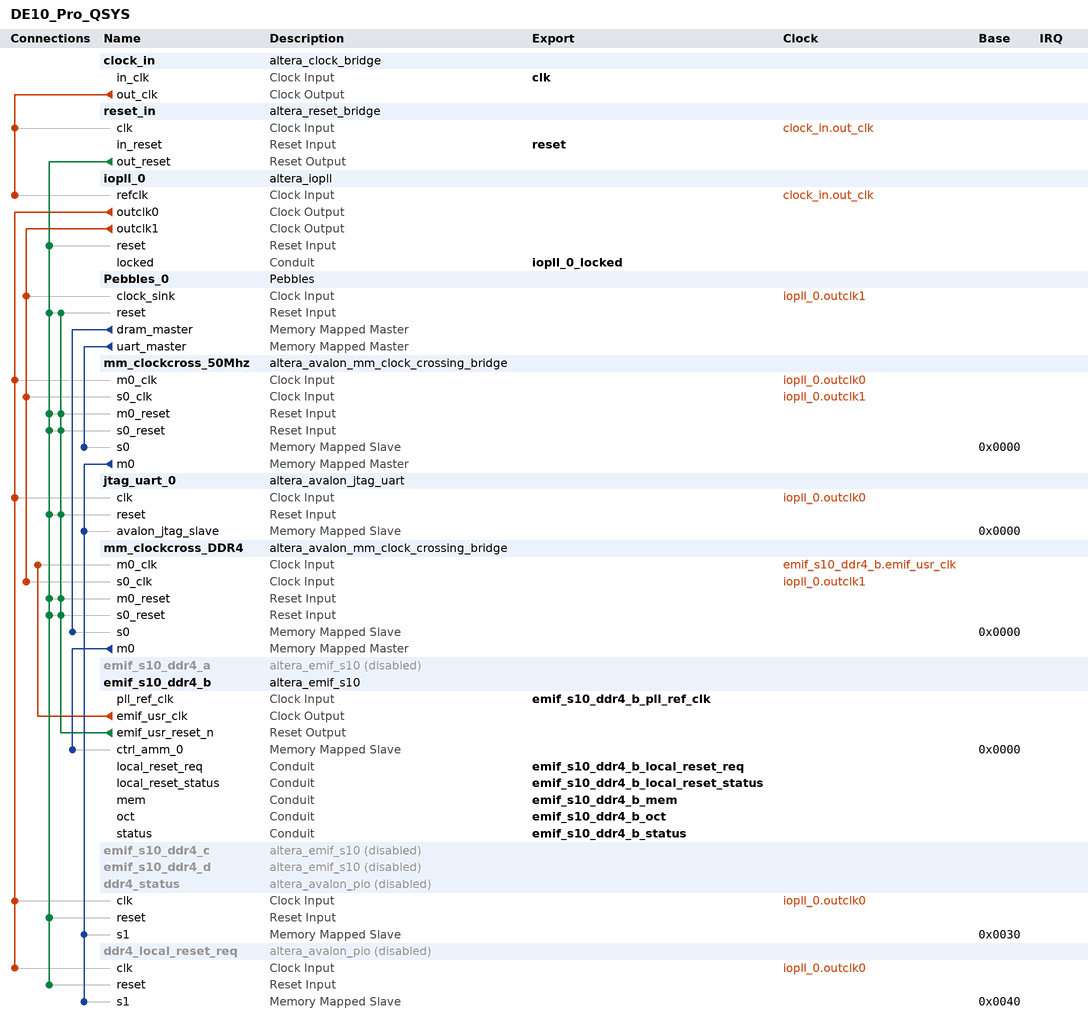
[diagram p0: system contents]
# Platform Designer (Qsys) system DE10_Pro_QSYS, Stratix 10 1SX280HU2F50E1VG
# Parameters at their usual value, and those the tool derives, are not listed.
package require -exact qsys 1.0
create_system DE10_Pro_QSYS
set_project_property DEVICE_FAMILY {Stratix 10}
set_project_property DEVICE 1SX280HU2F50E1VG

add_component clock_in ip/DE10_Pro_QSYS/DE10_Pro_QSYS_clock_in.ip altera_clock_bridge clock_in 19.1

add_component reset_in ip/DE10_Pro_QSYS/DE10_Pro_QSYS_reset_in.ip altera_reset_bridge reset_in 19.1

add_component iopll_0 ip/DE10_Pro_QSYS/DE10_Pro_QSYS_iopll_0.ip altera_iopll iopll_0 19.1

add_component Pebbles_0 ip/DE10_Pro_QSYS/DE10_Pro_QSYS_Pebbles_0.ip Pebbles Pebbles_0 1.0

add_component mm_clockcross_50Mhz ip/DE10_Pro_QSYS/DE10_Pro_QSYS_mm_clock_crossing_bridge_50m.ip altera_avalon_mm_clock_crossing_bridge mm_clockcross_50Mhz 19.1

add_component jtag_uart_0 ip/DE10_Pro_QSYS/DE10_Pro_QSYS_jtag_uart_0.ip altera_avalon_jtag_uart jtag_uart_0 19.1

add_component mm_clockcross_DDR4 ip/DE10_Pro_QSYS/DE10_Pro_QSYS_mm_clockcross_DDR4.ip altera_avalon_mm_clock_crossing_bridge mm_clockcross_DDR4 19.1
load_component mm_clockcross_DDR4
set_component_parameter_value DATA_WIDTH 512
set_component_parameter_value ADDRESS_WIDTH 26
set_component_parameter_value USE_AUTO_ADDRESS_WIDTH 1
set_component_parameter_value ADDRESS_UNITS WORDS
set_component_parameter_value MAX_BURST_SIZE 4
set_component_parameter_value COMMAND_FIFO_DEPTH 2
set_component_parameter_value RESPONSE_FIFO_DEPTH 32
set_component_parameter_value MASTER_SYNC_DEPTH 2
set_component_parameter_value SLAVE_SYNC_DEPTH 2
set_component_parameter_value SYNC_RESET 0
save_component

add_component emif_s10_ddr4_a ip/DE10_Pro_QSYS/DE10_Pro_QSYS_emif_s10_ddr4.ip altera_emif_s10 emif_s10_ddr4_a 19.1.0
set_instance_property emif_s10_ddr4_a ENABLED false

add_component emif_s10_ddr4_b ip/DE10_Pro_QSYS/DE10_Pro_QSYS_emif_s10_ddr4_b.ip altera_emif_s10 emif_s10_ddr4_b 19.1.0

add_component emif_s10_ddr4_c ip/DE10_Pro_QSYS/DE10_Pro_QSYS_emif_s10_ddr4_c.ip altera_emif_s10 emif_s10_ddr4_c 19.1.0
set_instance_property emif_s10_ddr4_c ENABLED false

add_component emif_s10_ddr4_d ip/DE10_Pro_QSYS/DE10_Pro_QSYS_emif_s10_ddr4_d.ip altera_emif_s10 emif_s10_ddr4_d 19.1.0
set_instance_property emif_s10_ddr4_d ENABLED false

add_component ddr4_status ip/DE10_Pro_QSYS/DE10_Pro_QSYS_pio_0.ip altera_avalon_pio ddr4_status 19.1
set_instance_property ddr4_status ENABLED false

add_component ddr4_local_reset_req ip/DE10_Pro_QSYS/DE10_Pro_QSYS_ddr4_local_reset_req.ip altera_avalon_pio ddr4_local_reset_req 19.1
set_instance_property ddr4_local_reset_req ENABLED false

# connections
add_connection clock_in.out_clk iopll_0.refclk clock
add_connection clock_in.out_clk reset_in.clk clock
add_connection emif_s10_ddr4_b.emif_usr_clk mm_clockcross_DDR4.m0_clk clock
add_connection iopll_0.outclk0 ddr4_local_reset_req.clk clock
add_connection iopll_0.outclk0 ddr4_status.clk clock
add_connection iopll_0.outclk0 jtag_uart_0.clk clock
add_connection iopll_0.outclk0 mm_clockcross_50Mhz.m0_clk clock
add_connection iopll_0.outclk1 mm_clockcross_50Mhz.s0_clk clock
add_connection iopll_0.outclk1 mm_clockcross_DDR4.s0_clk clock
add_connection iopll_0.outclk1 Pebbles_0.clock_sink clock
add_connection emif_s10_ddr4_b.emif_usr_reset_n jtag_uart_0.reset reset
add_connection emif_s10_ddr4_b.emif_usr_reset_n mm_clockcross_50Mhz.m0_reset reset
add_connection emif_s10_ddr4_b.emif_usr_reset_n mm_clockcross_50Mhz.s0_reset reset
add_connection emif_s10_ddr4_b.emif_usr_reset_n mm_clockcross_DDR4.m0_reset reset
add_connection emif_s10_ddr4_b.emif_usr_reset_n mm_clockcross_DDR4.s0_reset reset
add_connection emif_s10_ddr4_b.emif_usr_reset_n Pebbles_0.reset reset
add_connection reset_in.out_reset ddr4_local_reset_req.reset reset
add_connection reset_in.out_reset ddr4_status.reset reset
add_connection reset_in.out_reset iopll_0.reset reset
add_connection reset_in.out_reset jtag_uart_0.reset reset
add_connection reset_in.out_reset mm_clockcross_50Mhz.m0_reset reset
add_connection reset_in.out_reset mm_clockcross_50Mhz.s0_reset reset
add_connection reset_in.out_reset mm_clockcross_DDR4.m0_reset reset
add_connection reset_in.out_reset mm_clockcross_DDR4.s0_reset reset
add_connection reset_in.out_reset Pebbles_0.reset reset
add_connection mm_clockcross_50Mhz.m0 ddr4_local_reset_req.s1 avalon
set_connection_parameter_value mm_clockcross_50Mhz.m0/ddr4_local_reset_req.s1 baseAddress 0x0040
add_connection mm_clockcross_50Mhz.m0 ddr4_status.s1 avalon
set_connection_parameter_value mm_clockcross_50Mhz.m0/ddr4_status.s1 baseAddress 0x0030
add_connection mm_clockcross_50Mhz.m0 jtag_uart_0.avalon_jtag_slave avalon
set_connection_parameter_value mm_clockcross_50Mhz.m0/jtag_uart_0.avalon_jtag_slave baseAddress 0x0000
add_connection mm_clockcross_DDR4.m0 emif_s10_ddr4_b.ctrl_amm_0 avalon
set_connection_parameter_value mm_clockcross_DDR4.m0/emif_s10_ddr4_b.ctrl_amm_0 baseAddress 0x0000
add_connection Pebbles_0.dram_master mm_clockcross_DDR4.s0 avalon
set_connection_parameter_value Pebbles_0.dram_master/mm_clockcross_DDR4.s0 baseAddress 0x0000
add_connection Pebbles_0.uart_master mm_clockcross_50Mhz.s0 avalon
set_connection_parameter_value Pebbles_0.uart_master/mm_clockcross_50Mhz.s0 baseAddress 0x0000

# exported interfaces
add_interface clk clock sink
set_interface_property clk EXPORT_OF clock_in.in_clk
add_interface emif_s10_ddr4_b_local_reset_req conduit end
set_interface_property emif_s10_ddr4_b_local_reset_req EXPORT_OF emif_s10_ddr4_b.local_reset_req
add_interface emif_s10_ddr4_b_local_reset_status conduit end
set_interface_property emif_s10_ddr4_b_local_reset_status EXPORT_OF emif_s10_ddr4_b.local_reset_status
add_interface emif_s10_ddr4_b_mem conduit end
set_interface_property emif_s10_ddr4_b_mem EXPORT_OF emif_s10_ddr4_b.mem
add_interface emif_s10_ddr4_b_oct conduit end
set_interface_property emif_s10_ddr4_b_oct EXPORT_OF emif_s10_ddr4_b.oct
add_interface emif_s10_ddr4_b_pll_ref_clk clock sink
set_interface_property emif_s10_ddr4_b_pll_ref_clk EXPORT_OF emif_s10_ddr4_b.pll_ref_clk
add_interface emif_s10_ddr4_b_status conduit end
set_interface_property emif_s10_ddr4_b_status EXPORT_OF emif_s10_ddr4_b.status
add_interface iopll_0_locked conduit end
set_interface_property iopll_0_locked EXPORT_OF iopll_0.locked
add_interface reset reset sink
set_interface_property reset EXPORT_OF reset_in.in_reset

save_system DE10_Pro_QSYS.qsys
